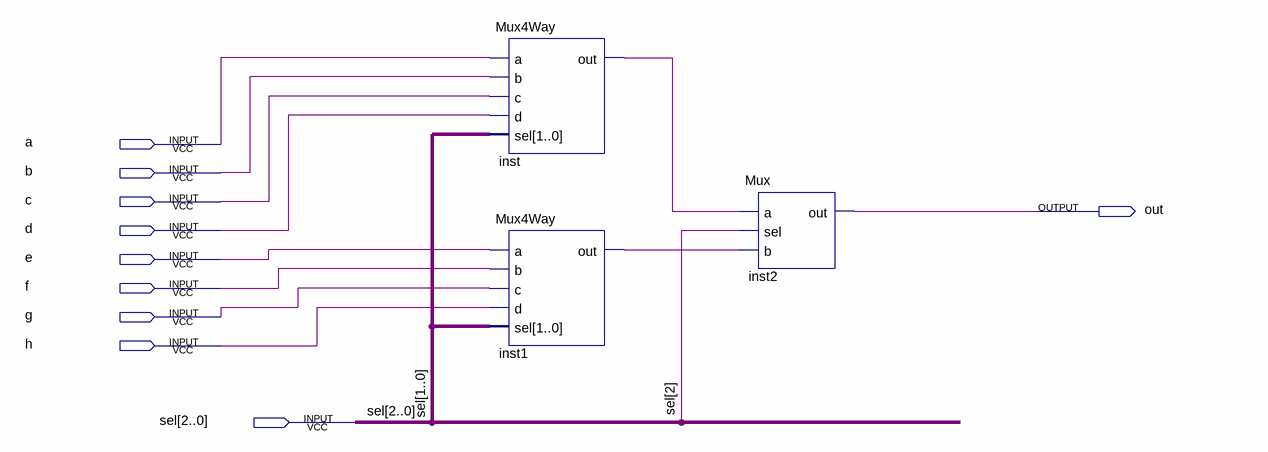
[diagram p0: schematic sheet]
// Quartus schematic Mux8Way.bdf as structural Verilog: 3 symbols, 10 pins
module Mux8Way (
  input  a,
  input  b,
  input  c,
  input  d,
  input  e,
  input  f,
  input  g,
  input  h,
  input  [2:0] sel,
  output out
);

  wire inst1_out, inst_out;

  Mux4Way inst (.a(a), .b(b), .c(c), .d(d), .sel(sel[1:0]), .out(inst_out));
  Mux4Way inst1 (.a(e), .b(f), .c(g), .d(h), .sel(sel[1:0]), .out(inst1_out));
  Mux inst2 (.a(inst_out), .sel(sel[2]), .b(inst1_out), .out(out));
endmodule
